# Altium schematic sheet Signal_Distribution.SchDoc
size A4; CompanyName: Technische Hochschule Nürnberg Georg Simon Ohm; Organization: UltraZohm; Address1: Kesslerplatz 12; Address2: 90489 Nürnberg; Address3: GERMANY; SheetNumber: 16; Website: www.ultrazohm.com
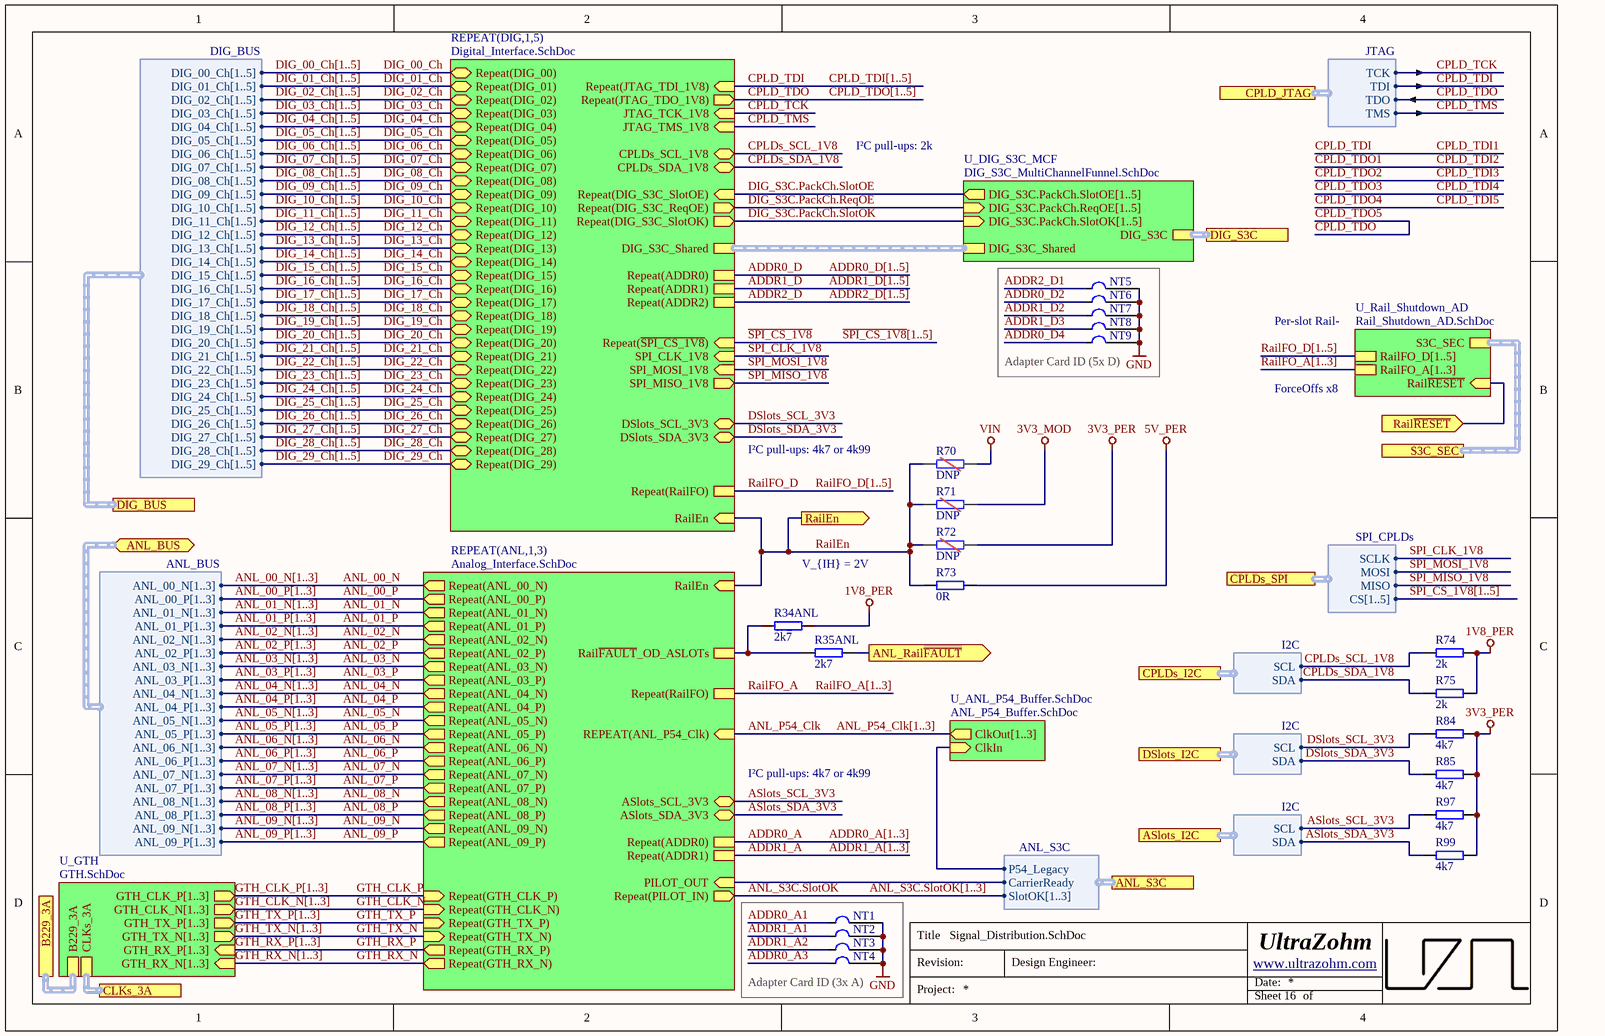
[diagram p0: Signal_Distribution.SchDoc]

## Parts
NT1  Net Tie 1 to 1  [1_to_1_NetTie_0.1mm]  (value not drawn)  (net tie, no BOM)
NT2  Net Tie 1 to 1  [1_to_1_NetTie_0.1mm]  (value not drawn)  (net tie, no BOM)
NT3  Net Tie 1 to 1  [1_to_1_NetTie_0.1mm]  (value not drawn)  (net tie, no BOM)
NT4  Net Tie 1 to 1  [1_to_1_NetTie_0.1mm]  (value not drawn)  (net tie, no BOM)
NT5  Net Tie 1 to 1  [1_to_1_NetTie_0.1mm]  (value not drawn)  (net tie, no BOM)
NT6  Net Tie 1 to 1  [1_to_1_NetTie_0.1mm]  (value not drawn)  (net tie, no BOM)
NT7  Net Tie 1 to 1  [1_to_1_NetTie_0.1mm]  (value not drawn)  (net tie, no BOM)
NT8  Net Tie 1 to 1  [1_to_1_NetTie_0.1mm]  (value not drawn)  (net tie, no BOM)
NT9  Net Tie 1 to 1  [1_to_1_NetTie_0.1mm]  (value not drawn)  (net tie, no BOM)
R34ANL  2k7  [R_0603_TE]
R35ANL  2k7  [R_0603_TE]
R70  DNP  [R_1206_TE-DNP]  (no BOM)
R71  DNP  [R_1206_TE-DNP]  (no BOM)
R72  DNP  [R_1206_TE-DNP]  (no BOM)
R73  0R  [R_1206_TE]
R74  2k  [R_0603_TE]
R75  2k  [R_0603_TE]
R84  4k7  [R_0603_TE]
R85  4k7  [R_0603_TE]
R97  4k7  [R_0603_TE]
R99  4k7  [R_0603_TE]

## Blocks framed on the sheet
Adapter Card ID (5x D): NT5-NT9
Adapter Card ID (3x A): NT1-NT4

## Sub-sheets
REPEAT(ANL,1,3) = Analog_Interface.SchDoc: Repeat(ANL_05_N) (out), Repeat(ANL_07_N) (out), Repeat(ANL_02_N) (out), Repeat(ANL_06_N) (out), Repeat(ANL_08_P) (out), Repeat(ANL_07_P) (out), Repeat(ANL_02_P) (out), Repeat(ANL_01_P) (out), Repeat(ANL_01_N) (out), Repeat(ANL_04_N) (out), Repeat(ANL_05_P) (out), Repeat(ANL_06_P) (out), Repeat(ANL_03_P) (out), Repeat(ANL_03_N) (out), Repeat(ANL_04_P) (out), Repeat(ANL_08_N) (out), PILOT_OUT (in), Repeat(ANL_00_P) (out), Repeat(ANL_09_P) (out), Repeat(PILOT_IN) (out), Repeat(ANL_09_N) (out), Repeat(ANL_00_N) (out), ASlots_SCL_3V3 (bidir), ASlots_SDA_3V3 (bidir), Repeat(GTH_CLK_P) (in), Repeat(GTH_CLK_N) (in), Repeat(GTH_TX_N) (in), Repeat(GTH_TX_P) (in), Repeat(GTH_RX_N) (out), Repeat(GTH_RX_P) (out), RailEn (in), Repeat(ADDR0), Repeat(ADDR1), REPEAT(ANL_P54_Clk) (in), Rail~{FAULT}_OD_ASLOTs, Repeat(RailFO)
REPEAT(DIG,1,5) = Digital_Interface.SchDoc: Repeat(DIG_01) (bidir), Repeat(DIG_03) (bidir), Repeat(DIG_05) (bidir), Repeat(DIG_07) (bidir), Repeat(DIG_09) (bidir), Repeat(DIG_11) (bidir), Repeat(DIG_13) (bidir), Repeat(DIG_15) (bidir), Repeat(DIG_17) (bidir), Repeat(DIG_19) (bidir), Repeat(DIG_21) (bidir), Repeat(DIG_23) (bidir), Repeat(DIG_25) (bidir), Repeat(DIG_27) (bidir), Repeat(DIG_29) (bidir), Repeat(DIG_02) (bidir), Repeat(DIG_04) (bidir), Repeat(DIG_06) (bidir), Repeat(DIG_08) (bidir), Repeat(DIG_10) (bidir), Repeat(DIG_12) (bidir), Repeat(DIG_14) (bidir), Repeat(DIG_16) (bidir), Repeat(DIG_18) (bidir), Repeat(DIG_20) (bidir), Repeat(DIG_22) (bidir), Repeat(DIG_24) (bidir), Repeat(DIG_26) (bidir), Repeat(DIG_28) (bidir), Repeat(DIG_00) (bidir), JTAG_TCK_1V8 (in), JTAG_TMS_1V8 (in), Repeat(JTAG_TDI_1V8) (in), Repeat(JTAG_TDO_1V8) (out), DSlots_SDA_3V3 (bidir), DSlots_SCL_3V3 (bidir), CPLDs_SDA_1V8 (bidir), CPLDs_SCL_1V8 (bidir), DIG_S3C_Shared (harness DIG_S3C_Shared), Repeat(DIG_S3C_SlotOE) (in), Repeat(DIG_S3C_ReqOE) (out), Repeat(~{SPI_CS_1V8}) (in), SPI_CLK_1V8 (in), SPI_MOSI_1V8 (in), SPI_MISO_1V8 (out), Repeat(DIG_S3C_SlotOK) (out), RailEn (in), Repeat(ADDR0), Repeat(ADDR1), Repeat(ADDR2), Repeat(RailFO)
U_ANL_P54_Buffer.SchDoc = ANL_P54_Buffer.SchDoc: ClkOut[1..3] (out), ClkIn (in)
U_DIG_S3C_MCF = DIG_S3C_MultiChannelFunnel.SchDoc: DIG_S3C (harness DIG_S3C), DIG_S3C_Shared (harness DIG_S3C_Shared), DIG_S3C.PackCh.SlotOE[1..5] (out), DIG_S3C.PackCh.ReqOE[1..5] (in), DIG_S3C.PackCh.SlotOK[1..5] (in)
U_GTH = GTH.SchDoc: GTH_CLK_P[1..3] (out), GTH_CLK_N[1..3] (out), GTH_TX_P[1..3] (out), GTH_TX_N[1..3] (out), GTH_RX_P[1..3] (in), GTH_RX_N[1..3] (in), B229_3A (harness MGT3), CLKs_3A (harness CLKs_3A)
U_Rail_Shutdown_AD = Rail_Shutdown_AD.SchDoc: S3C_SEC (harness I2C), Rail~{RESET} (in), RailFO_D[1..5], RailFO_A[1..3]

## Ports
ANL_BUS (bidir, harness ANL_BUS), ANL_Rail~{FAULT} (out), ANL_S3C (harness ANL_S3C), ASlots_I2C (harness I2C), B229_3A (harness MGT3), CLKs_3A (harness CLKs_3A), CPLD_JTAG (harness JTAG), CPLDs_I2C (harness I2C), CPLDs_SPI (harness SPI_CPLDs), DIG_BUS (harness DIG_BUS), DIG_S3C (harness DIG_S3C), DSlots_I2C (harness I2C), RailEn (out), Rail~{RESET} (in), S3C_SEC (harness I2C)

## Harnesses
DIG_BUS: DIG_01_Ch[1..5], DIG_02_Ch[1..5], DIG_03_Ch[1..5], DIG_04_Ch[1..5], DIG_05_Ch[1..5], DIG_06_Ch[1..5], DIG_07_Ch[1..5], DIG_08_Ch[1..5], DIG_09_Ch[1..5], DIG_10_Ch[1..5], DIG_11_Ch[1..5], DIG_12_Ch[1..5], DIG_13_Ch[1..5], DIG_14_Ch[1..5], DIG_15_Ch[1..5], DIG_16_Ch[1..5], DIG_17_Ch[1..5], DIG_18_Ch[1..5], DIG_19_Ch[1..5], DIG_20_Ch[1..5], DIG_21_Ch[1..5], DIG_22_Ch[1..5], DIG_23_Ch[1..5], DIG_24_Ch[1..5], DIG_25_Ch[1..5], DIG_26_Ch[1..5], DIG_27_Ch[1..5], DIG_28_Ch[1..5], DIG_29_Ch[1..5], DIG_00_Ch[1..5]
ANL_BUS: ANL_00_N[1..3], ANL_00_P[1..3], ANL_01_N[1..3], ANL_01_P[1..3], ANL_02_N[1..3], ANL_02_P[1..3], ANL_03_N[1..3], ANL_03_P[1..3], ANL_04_N[1..3], ANL_04_P[1..3], ANL_05_N[1..3], ANL_05_P[1..3], ANL_06_N[1..3], ANL_06_P[1..3], ANL_07_N[1..3], ANL_07_P[1..3], ANL_08_N[1..3], ANL_08_P[1..3], ANL_09_N[1..3], ANL_09_P[1..3]
I2C: SCL, SDA
SPI_CPLDs: SCLK, MOSI, MISO, CS[1..5]
JTAG: TCK, TDI, TDO, TMS
ANL_S3C: CarrierReady, SlotOK[1..3], P54_Legacy

## Nets
1V8_PER: R34ANL.2 R74.2 R75.2
3V3_MOD: R71.2
3V3_PER: R72.2 R84.2 R85.2 R97.2 R99.2
5V_PER: R73.2
GND: NT1.2 NT2.2 NT3.2 NT4.2 NT5.2 NT6.2 NT7.2 NT8.2 NT9.2
VIN: R70.2
ADDR0_A: sheet REPEAT(ANL,1,3)/Repeat(ADDR0)
ADDR0_A1: NT1.1
ADDR0_A3: NT4.1
ADDR0_D: sheet REPEAT(DIG,1,5)/Repeat(ADDR0)
ADDR0_D2: NT6.1
ADDR0_D4: NT9.1
ADDR1_A: sheet REPEAT(ANL,1,3)/Repeat(ADDR1)
ADDR1_A1: NT2.1
ADDR1_A2: NT3.1
ADDR1_D: sheet REPEAT(DIG,1,5)/Repeat(ADDR1)
ADDR1_D2: NT7.1
ADDR1_D3: NT8.1
ADDR2_D: sheet REPEAT(DIG,1,5)/Repeat(ADDR2)
ADDR2_D1: NT5.1
ANL_00_N: sheet REPEAT(ANL,1,3)/Repeat(ANL_00_N)
ANL_00_P: sheet REPEAT(ANL,1,3)/Repeat(ANL_00_P)
ANL_01_N: sheet REPEAT(ANL,1,3)/Repeat(ANL_01_N)
ANL_01_P: sheet REPEAT(ANL,1,3)/Repeat(ANL_01_P)
ANL_02_N: sheet REPEAT(ANL,1,3)/Repeat(ANL_02_N)
ANL_02_P: sheet REPEAT(ANL,1,3)/Repeat(ANL_02_P)
ANL_03_N: sheet REPEAT(ANL,1,3)/Repeat(ANL_03_N)
ANL_03_P: sheet REPEAT(ANL,1,3)/Repeat(ANL_03_P)
ANL_04_N: sheet REPEAT(ANL,1,3)/Repeat(ANL_04_N)
ANL_04_P: sheet REPEAT(ANL,1,3)/Repeat(ANL_04_P)
ANL_05_N: sheet REPEAT(ANL,1,3)/Repeat(ANL_05_N)
ANL_05_P: sheet REPEAT(ANL,1,3)/Repeat(ANL_05_P)
ANL_06_N: sheet REPEAT(ANL,1,3)/Repeat(ANL_06_N)
ANL_06_P: sheet REPEAT(ANL,1,3)/Repeat(ANL_06_P)
ANL_07_N: sheet REPEAT(ANL,1,3)/Repeat(ANL_07_N)
ANL_07_P: sheet REPEAT(ANL,1,3)/Repeat(ANL_07_P)
ANL_08_N: sheet REPEAT(ANL,1,3)/Repeat(ANL_08_N)
ANL_08_P: sheet REPEAT(ANL,1,3)/Repeat(ANL_08_P)
ANL_09_N: sheet REPEAT(ANL,1,3)/Repeat(ANL_09_N)
ANL_09_P: sheet REPEAT(ANL,1,3)/Repeat(ANL_09_P)
ANL_P54_Clk: sheet REPEAT(ANL,1,3)/REPEAT(ANL_P54_Clk)
ANL_Rail~{FAULT}: R35ANL.2 ; port ANL_Rail~{FAULT}
ANL_S3C.SlotOK: sheet REPEAT(ANL,1,3)/Repeat(PILOT_IN)
ASlots_SCL_3V3: R97.1 ; sheet REPEAT(ANL,1,3)/ASlots_SCL_3V3, port ASlots_I2C.SCL
ASlots_SDA_3V3: R99.1 ; sheet REPEAT(ANL,1,3)/ASlots_SDA_3V3, port ASlots_I2C.SDA
CPLD_TCK: sheet REPEAT(DIG,1,5)/JTAG_TCK_1V8, port CPLD_JTAG.TCK
CPLD_TDI: sheet REPEAT(DIG,1,5)/Repeat(JTAG_TDI_1V8), port CPLD_JTAG.TDI  [also labelled CPLD_TDI1]
CPLD_TDO: sheet REPEAT(DIG,1,5)/Repeat(JTAG_TDO_1V8), port CPLD_JTAG.TDO  [also labelled CPLD_TDO5]
CPLD_TMS: sheet REPEAT(DIG,1,5)/JTAG_TMS_1V8, port CPLD_JTAG.TMS
CPLDs_SCL_1V8: R74.1 ; sheet REPEAT(DIG,1,5)/CPLDs_SCL_1V8, port CPLDs_I2C.SCL
CPLDs_SDA_1V8: R75.1 ; sheet REPEAT(DIG,1,5)/CPLDs_SDA_1V8, port CPLDs_I2C.SDA
DIG_00_Ch: sheet REPEAT(DIG,1,5)/Repeat(DIG_00)
DIG_01_Ch: sheet REPEAT(DIG,1,5)/Repeat(DIG_01)
DIG_02_Ch: sheet REPEAT(DIG,1,5)/Repeat(DIG_02)
DIG_03_Ch: sheet REPEAT(DIG,1,5)/Repeat(DIG_03)
DIG_04_Ch: sheet REPEAT(DIG,1,5)/Repeat(DIG_04)
DIG_05_Ch: sheet REPEAT(DIG,1,5)/Repeat(DIG_05)
DIG_06_Ch: sheet REPEAT(DIG,1,5)/Repeat(DIG_06)
DIG_07_Ch: sheet REPEAT(DIG,1,5)/Repeat(DIG_07)
DIG_08_Ch: sheet REPEAT(DIG,1,5)/Repeat(DIG_08)
DIG_09_Ch: sheet REPEAT(DIG,1,5)/Repeat(DIG_09)
DIG_10_Ch: sheet REPEAT(DIG,1,5)/Repeat(DIG_10)
DIG_11_Ch: sheet REPEAT(DIG,1,5)/Repeat(DIG_11)
DIG_12_Ch: sheet REPEAT(DIG,1,5)/Repeat(DIG_12)
DIG_13_Ch: sheet REPEAT(DIG,1,5)/Repeat(DIG_13)
DIG_14_Ch: sheet REPEAT(DIG,1,5)/Repeat(DIG_14)
DIG_15_Ch: sheet REPEAT(DIG,1,5)/Repeat(DIG_15)
DIG_16_Ch: sheet REPEAT(DIG,1,5)/Repeat(DIG_16)
DIG_17_Ch: sheet REPEAT(DIG,1,5)/Repeat(DIG_17)
DIG_18_Ch: sheet REPEAT(DIG,1,5)/Repeat(DIG_18)
DIG_19_Ch: sheet REPEAT(DIG,1,5)/Repeat(DIG_19)
DIG_20_Ch: sheet REPEAT(DIG,1,5)/Repeat(DIG_20)
DIG_21_Ch: sheet REPEAT(DIG,1,5)/Repeat(DIG_21)
DIG_22_Ch: sheet REPEAT(DIG,1,5)/Repeat(DIG_22)
DIG_23_Ch: sheet REPEAT(DIG,1,5)/Repeat(DIG_23)
DIG_24_Ch: sheet REPEAT(DIG,1,5)/Repeat(DIG_24)
DIG_25_Ch: sheet REPEAT(DIG,1,5)/Repeat(DIG_25)
DIG_26_Ch: sheet REPEAT(DIG,1,5)/Repeat(DIG_26)
DIG_27_Ch: sheet REPEAT(DIG,1,5)/Repeat(DIG_27)
DIG_28_Ch: sheet REPEAT(DIG,1,5)/Repeat(DIG_28)
DIG_29_Ch: sheet REPEAT(DIG,1,5)/Repeat(DIG_29)
DIG_S3C.PackCh.ReqOE: sheet REPEAT(DIG,1,5)/Repeat(DIG_S3C_ReqOE)
DIG_S3C.PackCh.SlotOE: sheet REPEAT(DIG,1,5)/Repeat(DIG_S3C_SlotOE)
DIG_S3C.PackCh.SlotOK: sheet REPEAT(DIG,1,5)/Repeat(DIG_S3C_SlotOK)
DSlots_SCL_3V3: R84.1 ; sheet REPEAT(DIG,1,5)/DSlots_SCL_3V3, port DSlots_I2C.SCL
DSlots_SDA_3V3: R85.1 ; sheet REPEAT(DIG,1,5)/DSlots_SDA_3V3, port DSlots_I2C.SDA
GTH_CLK_N: sheet REPEAT(ANL,1,3)/Repeat(GTH_CLK_N)
GTH_CLK_P: sheet REPEAT(ANL,1,3)/Repeat(GTH_CLK_P)
GTH_RX_N: sheet REPEAT(ANL,1,3)/Repeat(GTH_RX_N)
GTH_RX_P: sheet REPEAT(ANL,1,3)/Repeat(GTH_RX_P)
GTH_TX_N: sheet REPEAT(ANL,1,3)/Repeat(GTH_TX_N)
GTH_TX_P: sheet REPEAT(ANL,1,3)/Repeat(GTH_TX_P)
RailEn: R70.1 R71.1 R72.1 R73.1 ; port RailEn, sheet REPEAT(DIG,1,5)/RailEn, sheet REPEAT(ANL,1,3)/RailEn
RailFO_A: sheet REPEAT(ANL,1,3)/Repeat(RailFO)
RailFO_D: sheet REPEAT(DIG,1,5)/Repeat(RailFO)
Rail~{RESET}: port Rail~{RESET}, sheet U_Rail_Shutdown_AD/Rail~{RESET}
~{SPI_CS_1V8}: sheet REPEAT(DIG,1,5)/Repeat(~{SPI_CS_1V8})
SPI_CLK_1V8: sheet REPEAT(DIG,1,5)/SPI_CLK_1V8, port CPLDs_SPI.SCLK
SPI_MISO_1V8: sheet REPEAT(DIG,1,5)/SPI_MISO_1V8, port CPLDs_SPI.MISO
SPI_MOSI_1V8: sheet REPEAT(DIG,1,5)/SPI_MOSI_1V8, port CPLDs_SPI.MOSI
NetR34ANL_1: R34ANL.1 R35ANL.1 ; sheet REPEAT(ANL,1,3)/Rail~{FAULT}_OD_ASLOTs
(unnamed): sheet REPEAT(ANL,1,3)/PILOT_OUT, port ANL_S3C.CarrierReady
(unnamed): sheet U_ANL_P54_Buffer.SchDoc/ClkIn, port ANL_S3C.P54_Legacy

## Buses and harness runs
bus ADDR0_A[1..3]
bus ADDR0_D[1..5]
bus ADDR1_A[1..3]
bus ADDR1_D[1..5]
bus ADDR2_D[1..5]
bus ANL_00_N[1..3]
bus ANL_00_P[1..3]
bus ANL_01_N[1..3]
bus ANL_01_P[1..3]
bus ANL_02_N[1..3]
bus ANL_02_P[1..3]
bus ANL_03_N[1..3]
bus ANL_03_P[1..3]
bus ANL_04_N[1..3]
bus ANL_04_P[1..3]
bus ANL_05_N[1..3]
bus ANL_05_P[1..3]
bus ANL_06_N[1..3]
bus ANL_06_P[1..3]
bus ANL_07_N[1..3]
bus ANL_07_P[1..3]
bus ANL_08_N[1..3]
bus ANL_08_P[1..3]
bus ANL_09_N[1..3]
bus ANL_09_P[1..3]
bus ANL_P54_Clk[1..3] = sheet U_ANL_P54_Buffer.SchDoc/ClkOut[1..3]
bus ANL_S3C.SlotOK[1..3]
bus CPLD_TDI[1..5]
bus CPLD_TDO[1..5]
bus DIG_00_Ch[1..5]
bus DIG_01_Ch[1..5]
bus DIG_02_Ch[1..5]
bus DIG_03_Ch[1..5]
bus DIG_04_Ch[1..5]
bus DIG_05_Ch[1..5]
bus DIG_06_Ch[1..5]
bus DIG_07_Ch[1..5]
bus DIG_08_Ch[1..5]
bus DIG_09_Ch[1..5]
bus DIG_10_Ch[1..5]
bus DIG_11_Ch[1..5]
bus DIG_12_Ch[1..5]
bus DIG_13_Ch[1..5]
bus DIG_14_Ch[1..5]
bus DIG_15_Ch[1..5]
bus DIG_16_Ch[1..5]
bus DIG_17_Ch[1..5]
bus DIG_18_Ch[1..5]
bus DIG_19_Ch[1..5]
bus DIG_20_Ch[1..5]
bus DIG_21_Ch[1..5]
bus DIG_22_Ch[1..5]
bus DIG_23_Ch[1..5]
bus DIG_24_Ch[1..5]
bus DIG_25_Ch[1..5]
bus DIG_26_Ch[1..5]
bus DIG_27_Ch[1..5]
bus DIG_28_Ch[1..5]
bus DIG_29_Ch[1..5]
bus GTH_CLK_N[1..3] = sheet U_GTH/GTH_CLK_N[1..3]
bus GTH_CLK_P[1..3] = sheet U_GTH/GTH_CLK_P[1..3]
bus GTH_RX_N[1..3] = sheet U_GTH/GTH_RX_N[1..3]
bus GTH_RX_P[1..3] = sheet U_GTH/GTH_RX_P[1..3]
bus GTH_TX_N[1..3] = sheet U_GTH/GTH_TX_N[1..3]
bus GTH_TX_P[1..3] = sheet U_GTH/GTH_TX_P[1..3]
bus RailFO_A[1..3]
bus RailFO_A[1..3] = sheet U_Rail_Shutdown_AD/RailFO_A[1..3]
bus RailFO_D[1..5]
bus RailFO_D[1..5] = sheet U_Rail_Shutdown_AD/RailFO_D[1..5]
bus ~{SPI_CS_1V8}[1..5]
harness port B229_3A = sheet U_GTH/B229_3A
harness port CLKs_3A = sheet U_GTH/CLKs_3A
harness port DIG_S3C = sheet U_DIG_S3C_MCF/DIG_S3C
harness port S3C_SEC = sheet U_Rail_Shutdown_AD/S3C_SEC
harness sheet REPEAT(DIG,1,5)/DIG_S3C_Shared = sheet U_DIG_S3C_MCF/DIG_S3C_Shared

## Notes on the sheet
- I²C pull-ups: 2k
- Per-slot Rail-
- ForceOffs x8
- I²C pull-ups: 4k7 or 4k99
- V_{IH} = 2V
- Title
- Revision:
- Design Engineer:
- Date:
- Project:
- Sheet
- of

## Library data of the parts
NT1-NT9 = Net Tie 1 to 1: Net Tie 1 to 1. Joins two nets without producing a DRC error or renaming one of the nets; PartID: 2; Created On: 29/09/2024 15:25:00; Component Type: Net Tie 1 to 1; Last Updated: 29/09/2024 15:25:00; Type: Net Tie (No BOM); Created by: MGeier; Live Cycle Status: 1
R34ANL R35ANL = UZgen_R_0603_2k7: Generic resistor; Manufacturer: UZgen; Tolerance: 1 %; Created from: UZgenTool; Manufacturer Part Number: UZgen_R_0603_2k7; PartID: 231; Created On: 02/07/2024 17:29:49; Value: 2k7; Device Package: 0603; Mounting Type: SMD; Last Updated: 02/07/2024 17:29:49
R70-R72 = UZgen_R_1206_DNP: Generic resistor (DNP); Manufacturer: UZgen; Created from: UZgenTool; Manufacturer Part Number: UZgen_R_1206_DNP; PartID: 595; Created On: 25/03/2025 14:26:15; Value: DNP; Device Package: 1206; Tolerance: -; Mounting Type: SMD; Last Updated: 02/04/2025 19:05:00
R73 = UZgen_R_1206_0R: Generic resistor; Manufacturer: UZgen; Tolerance: 1 %; Created from: UZgenTool; Manufacturer Part Number: UZgen_R_1206_0R; PartID: 583; Created On: 08/07/2024 14:34:30; Value: 0R; Device Package: 1206; Mounting Type: SMD; Last Updated: 08/07/2024 14:34:30
R74 R75 = UZgen_R_0603_2k: Generic resistor; Manufacturer: UZgen; Tolerance: 1 %; Created from: UZgenTool; Manufacturer Part Number: UZgen_R_0603_2k; PartID: 228; Created On: 02/07/2024 17:29:49; Value: 2k; Device Package: 0603; Mounting Type: SMD; Last Updated: 02/07/2024 17:29:49
R84 R85 R97 R99 = UZgen_R_0603_4k7: Generic resistor; Manufacturer: UZgen; Tolerance: 1 %; Created from: UZgenTool; Manufacturer Part Number: UZgen_R_0603_4k7; PartID: 237; Created On: 02/07/2024 17:29:50; Value: 4k7; Device Package: 0603; Mounting Type: SMD; Last Updated: 02/07/2024 17:29:50